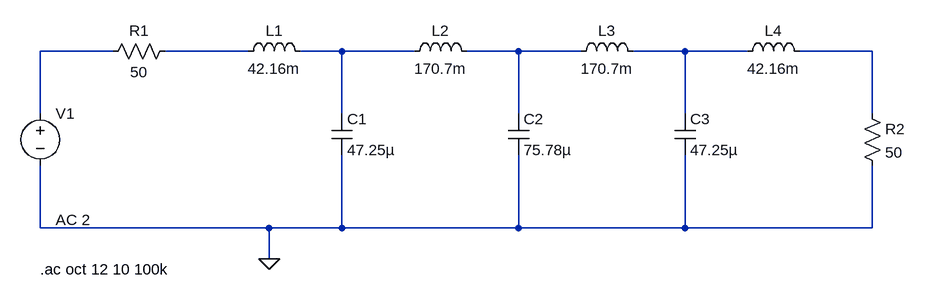
[diagram p0: schematic Draft3 Lowpass.asc]
Draft3 Lowpass.asc, the LTspice schematic file:
Version 4.1
SHEET 1 1976 680
WIRE 240 0 128 0
WIRE 448 0 320 0
WIRE 592 0 528 0
WIRE 704 0 592 0
WIRE 864 0 784 0
WIRE 960 0 864 0
WIRE 1120 0 1040 0
WIRE 1216 0 1120 0
WIRE 1408 0 1296 0
WIRE 128 96 128 0
WIRE 592 96 592 0
WIRE 864 96 864 0
WIRE 1120 96 1120 0
WIRE 1408 96 1408 0
WIRE 128 272 128 176
WIRE 480 272 128 272
WIRE 592 272 592 160
WIRE 592 272 480 272
WIRE 864 272 864 160
WIRE 864 272 592 272
WIRE 1120 272 1120 160
WIRE 1120 272 864 272
WIRE 1408 272 1408 176
WIRE 1408 272 1120 272
WIRE 480 320 480 272
FLAG 480 320 0
SYMBOL voltage 128 80 R0
WINDOW 3 24 152 Left 2
WINDOW 123 24 180 Left 2
WINDOW 39 0 0 Left 0
SYMATTR Value ""
SYMATTR Value2 AC 2
SYMATTR InstName V1
SYMBOL res 336 -16 R90
WINDOW 0 0 56 VBottom 2
WINDOW 3 32 56 VTop 2
SYMATTR InstName R1
SYMATTR Value 50
SYMBOL res 1392 80 R0
SYMATTR InstName R2
SYMATTR Value 50
SYMBOL ind 432 16 R270
WINDOW 0 32 56 VTop 2
WINDOW 3 5 56 VBottom 2
SYMATTR InstName L1
SYMATTR Value 42.16m
SYMBOL ind 688 16 R270
WINDOW 0 32 56 VTop 2
WINDOW 3 5 56 VBottom 2
SYMATTR InstName L2
SYMATTR Value 170.7m
SYMBOL ind 944 16 R270
WINDOW 0 32 56 VTop 2
WINDOW 3 5 56 VBottom 2
SYMATTR InstName L3
SYMATTR Value 170.7m
SYMBOL ind 1200 16 R270
WINDOW 0 32 56 VTop 2
WINDOW 3 5 56 VBottom 2
SYMATTR InstName L4
SYMATTR Value 42.16m
SYMBOL cap 576 96 R0
SYMATTR InstName C1
SYMATTR Value 47.25µ
SYMBOL cap 848 96 R0
SYMATTR InstName C2
SYMATTR Value 75.78µ
SYMBOL cap 1104 96 R0
SYMATTR InstName C3
SYMATTR Value 47.25µ
TEXT 128 336 Left 2 !.ac oct 12 10 100k

The netlist it stands for:
* Draft3 Lowpass.asc
V1 N001 0 AC 2
R1 N002 N001 50
R2 N006 0 50
L1 N002 N003 42.16m
L2 N003 N004 170.7m
L3 N004 N005 170.7m
L4 N005 N006 42.16m
C1 N003 0 47.25µ
C2 N004 0 75.78µ
C3 N005 0 47.25µ
.ac oct 12 10 100k
.backanno
.end